# Altium project split_action.PrjPcb
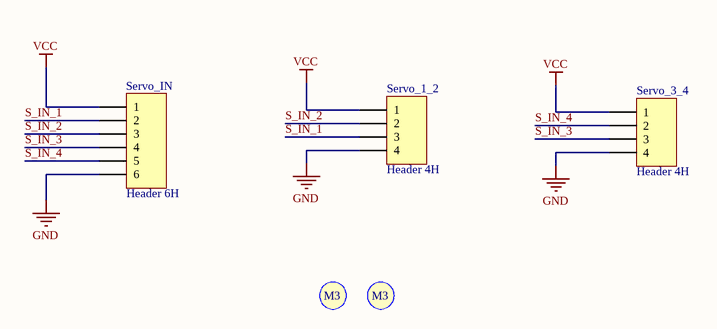
[diagram p0: SchemaSplit.SchDoc]
1 sheet, 5 parts. Net scope: global (net labels, ports and power ports of the same name join across sheets).
Board file: PCB_split_action.PcbDoc

## Sheet SchemaSplit.SchDoc
size A4; SheetNumber: 1; SheetTotal: 1

### Parts
S1  Screw M3  [Screw M3]  (value not drawn)
S2  Screw M3  [Screw M3]  (value not drawn)
Servo_1_2  Header 4H  [S4B-XH-A]
Servo_3_4  Header 4H  [S4B-XH-A]
Servo_IN  Header 6H  [S6B-XH-A]

### Nets
GND: Servo_1_2.4 Servo_3_4.4 Servo_IN.6
VCC: Servo_1_2.1 Servo_3_4.1 Servo_IN.1
S_IN_1: Servo_1_2.3 Servo_IN.2
S_IN_2: Servo_1_2.2 Servo_IN.3
S_IN_3: Servo_3_4.3 Servo_IN.4
S_IN_4: Servo_3_4.2 Servo_IN.5

### Notes on the sheet
- (in symbol Screw M3) M3

### Library data of the parts
Servo_1_2 Servo_3_4 = Header 4H: Header, 4-Pin, Right Angle; LatestRevisionDate: 17-Jul-2002; LatestRevisionNote: Re-released for DXP Platform.; Publisher: Altium Limited
Servo_IN = Header 6H: Header, 6-Pin, Right Angle; LatestRevisionDate: 17-Jul-2002; LatestRevisionNote: Re-released for DXP Platform.; Publisher: Altium Limited